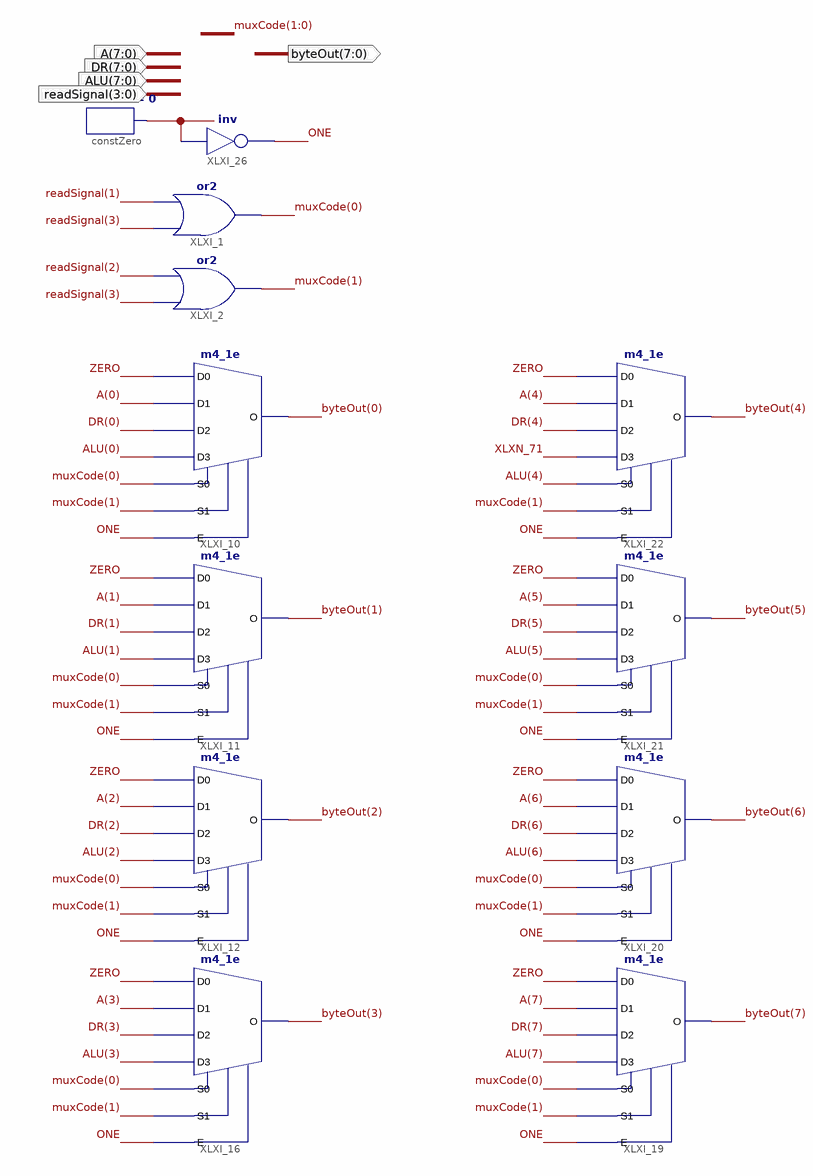
[diagram p0: schematic sheet 1]
// Xilinx ISE schematic CU_Read_MUX.sch (spartan3e) as structural Verilog: 12 symbols, 5 ports
module CU_Read_MUX (
  input  [7:0] A,
  input  [7:0] DR,
  input  [7:0] ALU,
  input  [3:0] readSignal,
  output [7:0] byteOut
);

  wire ONE, XLXN_71, ZERO;
  wire [1:0] muxCode;

  m4_1e XLXI_10 (
    .D0(ZERO), .D1(A[0]), .D2(DR[0]), .D3(ALU[0]), .E(ONE), .S0(muxCode[0]), .S1(muxCode[1]), .O(byteOut[0]));
  m4_1e XLXI_11 (
    .D0(ZERO), .D1(A[1]), .D2(DR[1]), .D3(ALU[1]), .E(ONE), .S0(muxCode[0]), .S1(muxCode[1]), .O(byteOut[1]));
  m4_1e XLXI_12 (
    .D0(ZERO), .D1(A[2]), .D2(DR[2]), .D3(ALU[2]), .E(ONE), .S0(muxCode[0]), .S1(muxCode[1]), .O(byteOut[2]));
  m4_1e XLXI_16 (
    .D0(ZERO), .D1(A[3]), .D2(DR[3]), .D3(ALU[3]), .E(ONE), .S0(muxCode[0]), .S1(muxCode[1]), .O(byteOut[3]));
  m4_1e XLXI_19 (
    .D0(ZERO), .D1(A[7]), .D2(DR[7]), .D3(ALU[7]), .E(ONE), .S0(muxCode[0]), .S1(muxCode[1]), .O(byteOut[7]));
  m4_1e XLXI_20 (
    .D0(ZERO), .D1(A[6]), .D2(DR[6]), .D3(ALU[6]), .E(ONE), .S0(muxCode[0]), .S1(muxCode[1]), .O(byteOut[6]));
  m4_1e XLXI_21 (
    .D0(ZERO), .D1(A[5]), .D2(DR[5]), .D3(ALU[5]), .E(ONE), .S0(muxCode[0]), .S1(muxCode[1]), .O(byteOut[5]));
  m4_1e XLXI_22 (.D0(ZERO), .D1(A[4]), .D2(DR[4]), .D3(XLXN_71), .E(ONE), .S0(ALU[4]), .S1(muxCode[1]), .O(byteOut[4]));
  or XLXI_1 (muxCode[0], readSignal[3], readSignal[1]);
  or XLXI_2 (muxCode[1], readSignal[3], readSignal[2]);
  constant #(.CValue("0")) constZero (.O(ZERO));
  not XLXI_26 (ONE, ZERO);
endmodule
